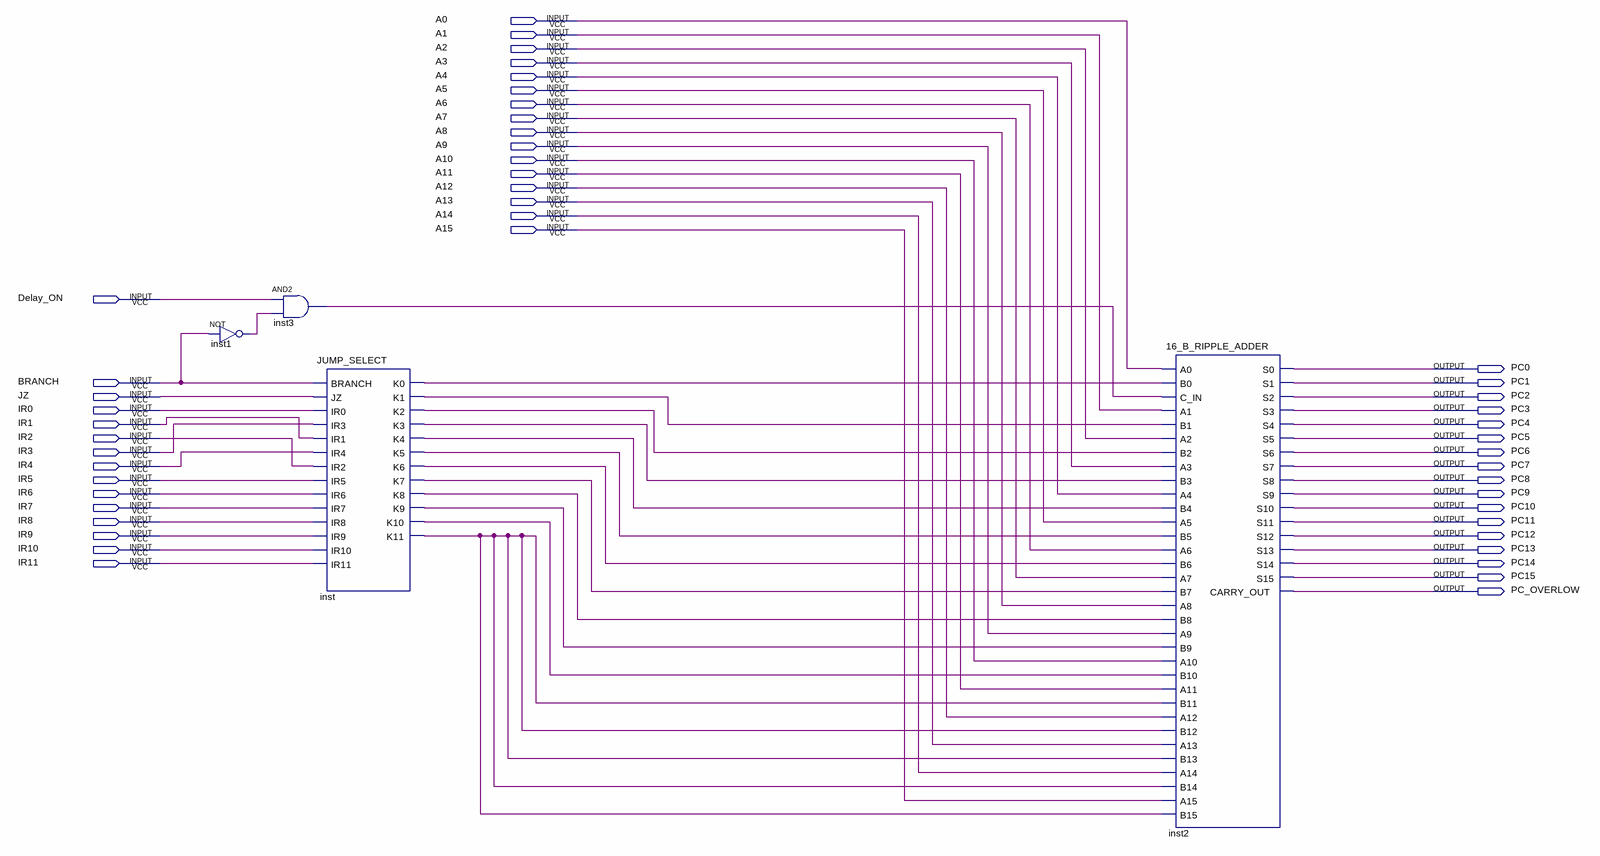
[diagram p0: schematic sheet]
// Quartus schematic PC_ALU_TOP_LEVEL.bdf as structural Verilog: 4 symbols, 48 pins
module PC_ALU_TOP_LEVEL (
  input  A0,
  input  A1,
  input  A2,
  input  A3,
  input  A4,
  input  A5,
  input  A6,
  input  A7,
  input  A8,
  input  A9,
  input  A10,
  input  A11,
  input  A12,
  input  A13,
  input  A14,
  input  A15,
  input  Delay_ON,
  input  BRANCH,
  input  JZ,
  input  IR0,
  input  IR1,
  input  IR2,
  input  IR3,
  input  IR4,
  input  IR5,
  input  IR6,
  input  IR7,
  input  IR8,
  input  IR9,
  input  IR10,
  input  IR11,
  output PC0,
  output PC1,
  output PC2,
  output PC3,
  output PC4,
  output PC5,
  output PC6,
  output PC7,
  output PC8,
  output PC9,
  output PC10,
  output PC11,
  output PC12,
  output PC13,
  output PC14,
  output PC15,
  output PC_OVERLOW
);

  wire inst1_out, inst3_out, inst_k0, inst_k1, inst_k2, inst_k3, inst_k4, inst_k5, inst_k6, inst_k7, inst_k8,
       inst_k9, inst_k10, inst_k11;

  not inst1 (inst1_out, BRANCH);
  and inst3 (inst3_out, Delay_ON, inst1_out);
  JUMP_SELECT inst (
    .BRANCH(BRANCH), .JZ(JZ), .IR0(IR0), .IR3(IR3), .IR1(IR1), .IR4(IR4), .IR2(IR2), .IR5(IR5), .IR6(IR6),
    .IR7(IR7), .IR8(IR8), .IR9(IR9), .IR10(IR10), .IR11(IR11), .K0(inst_k0), .K1(inst_k1), .K2(inst_k2),
    .K3(inst_k3), .K4(inst_k4), .K5(inst_k5), .K6(inst_k6), .K7(inst_k7), .K8(inst_k8), .K9(inst_k9),
    .K10(inst_k10), .K11(inst_k11));
  \16_B_RIPPLE_ADDER  inst2 (
    .A0(A0), .B0(inst_k0), .C_IN(inst3_out), .A1(A1), .B1(inst_k1), .A2(A2), .B2(inst_k2), .A3(A3),
    .B3(inst_k3), .A4(A4), .B4(inst_k4), .A5(A5), .B5(inst_k5), .A6(A6), .B6(inst_k6), .A7(A7), .B7(inst_k7),
    .A8(A8), .B8(inst_k8), .A9(A9), .B9(inst_k9), .A10(A10), .B10(inst_k10), .A11(A11), .B11(inst_k11),
    .A12(A12), .B12(inst_k11), .A13(A13), .B13(inst_k11), .A14(A14), .B14(inst_k11), .A15(A15),
    .B15(inst_k11), .S0(PC0), .S1(PC1), .S2(PC2), .S3(PC3), .S4(PC4), .S5(PC5), .S6(PC6), .S7(PC7), .S8(PC8),
    .S9(PC9), .S10(PC10), .S11(PC11), .S12(PC12), .S13(PC13), .S14(PC14), .S15(PC15), .CARRY_OUT(PC_OVERLOW));
endmodule
